# Altium schematic sheet EMG_CHANNEL_2_ANALOG.SchDoc
size 594 x 420 mm
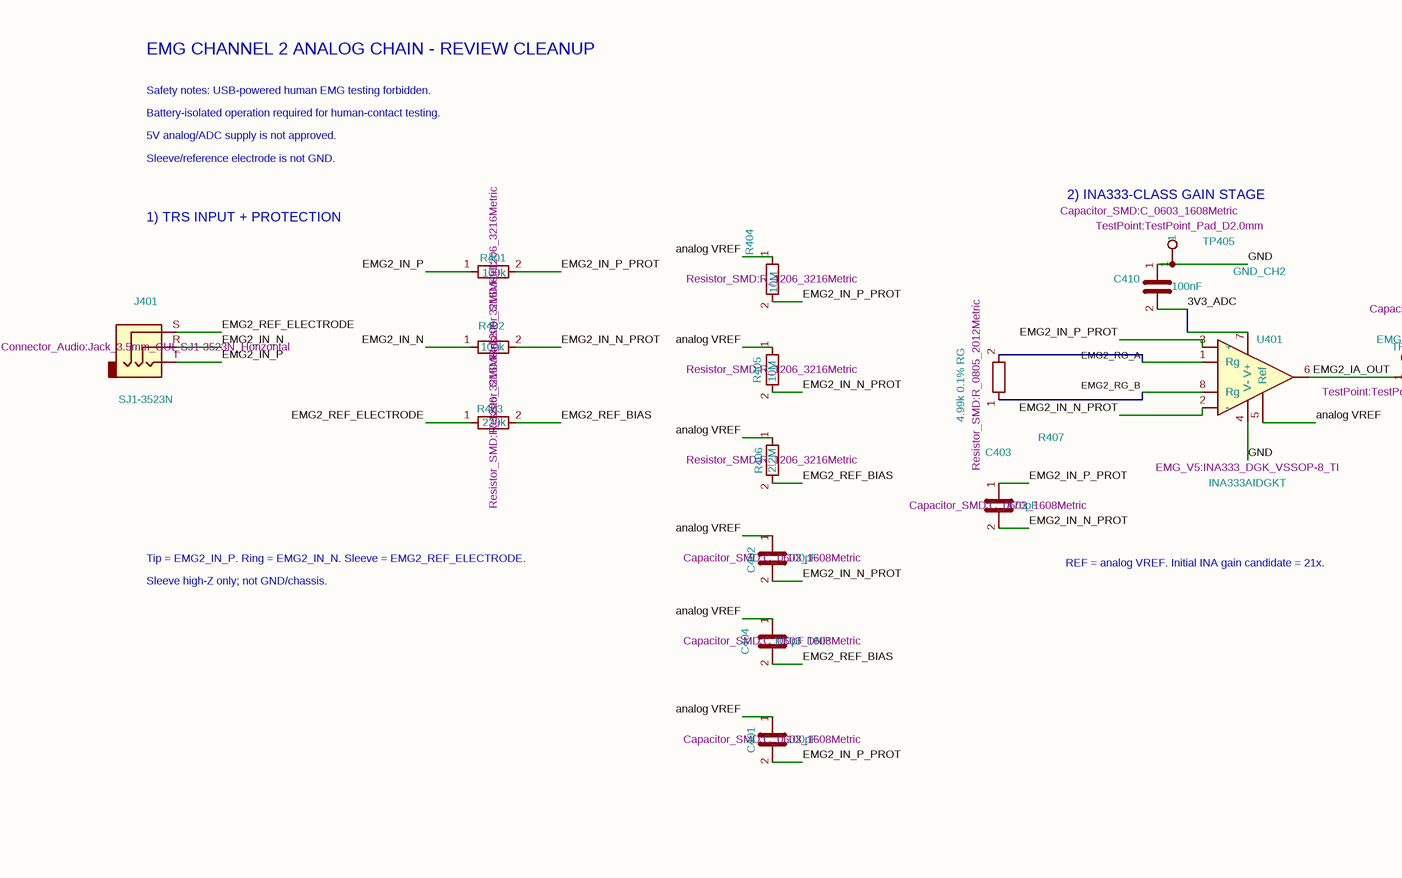
[diagram p0: EMG_CHANNEL_2_ANALOG.SchDoc, left]
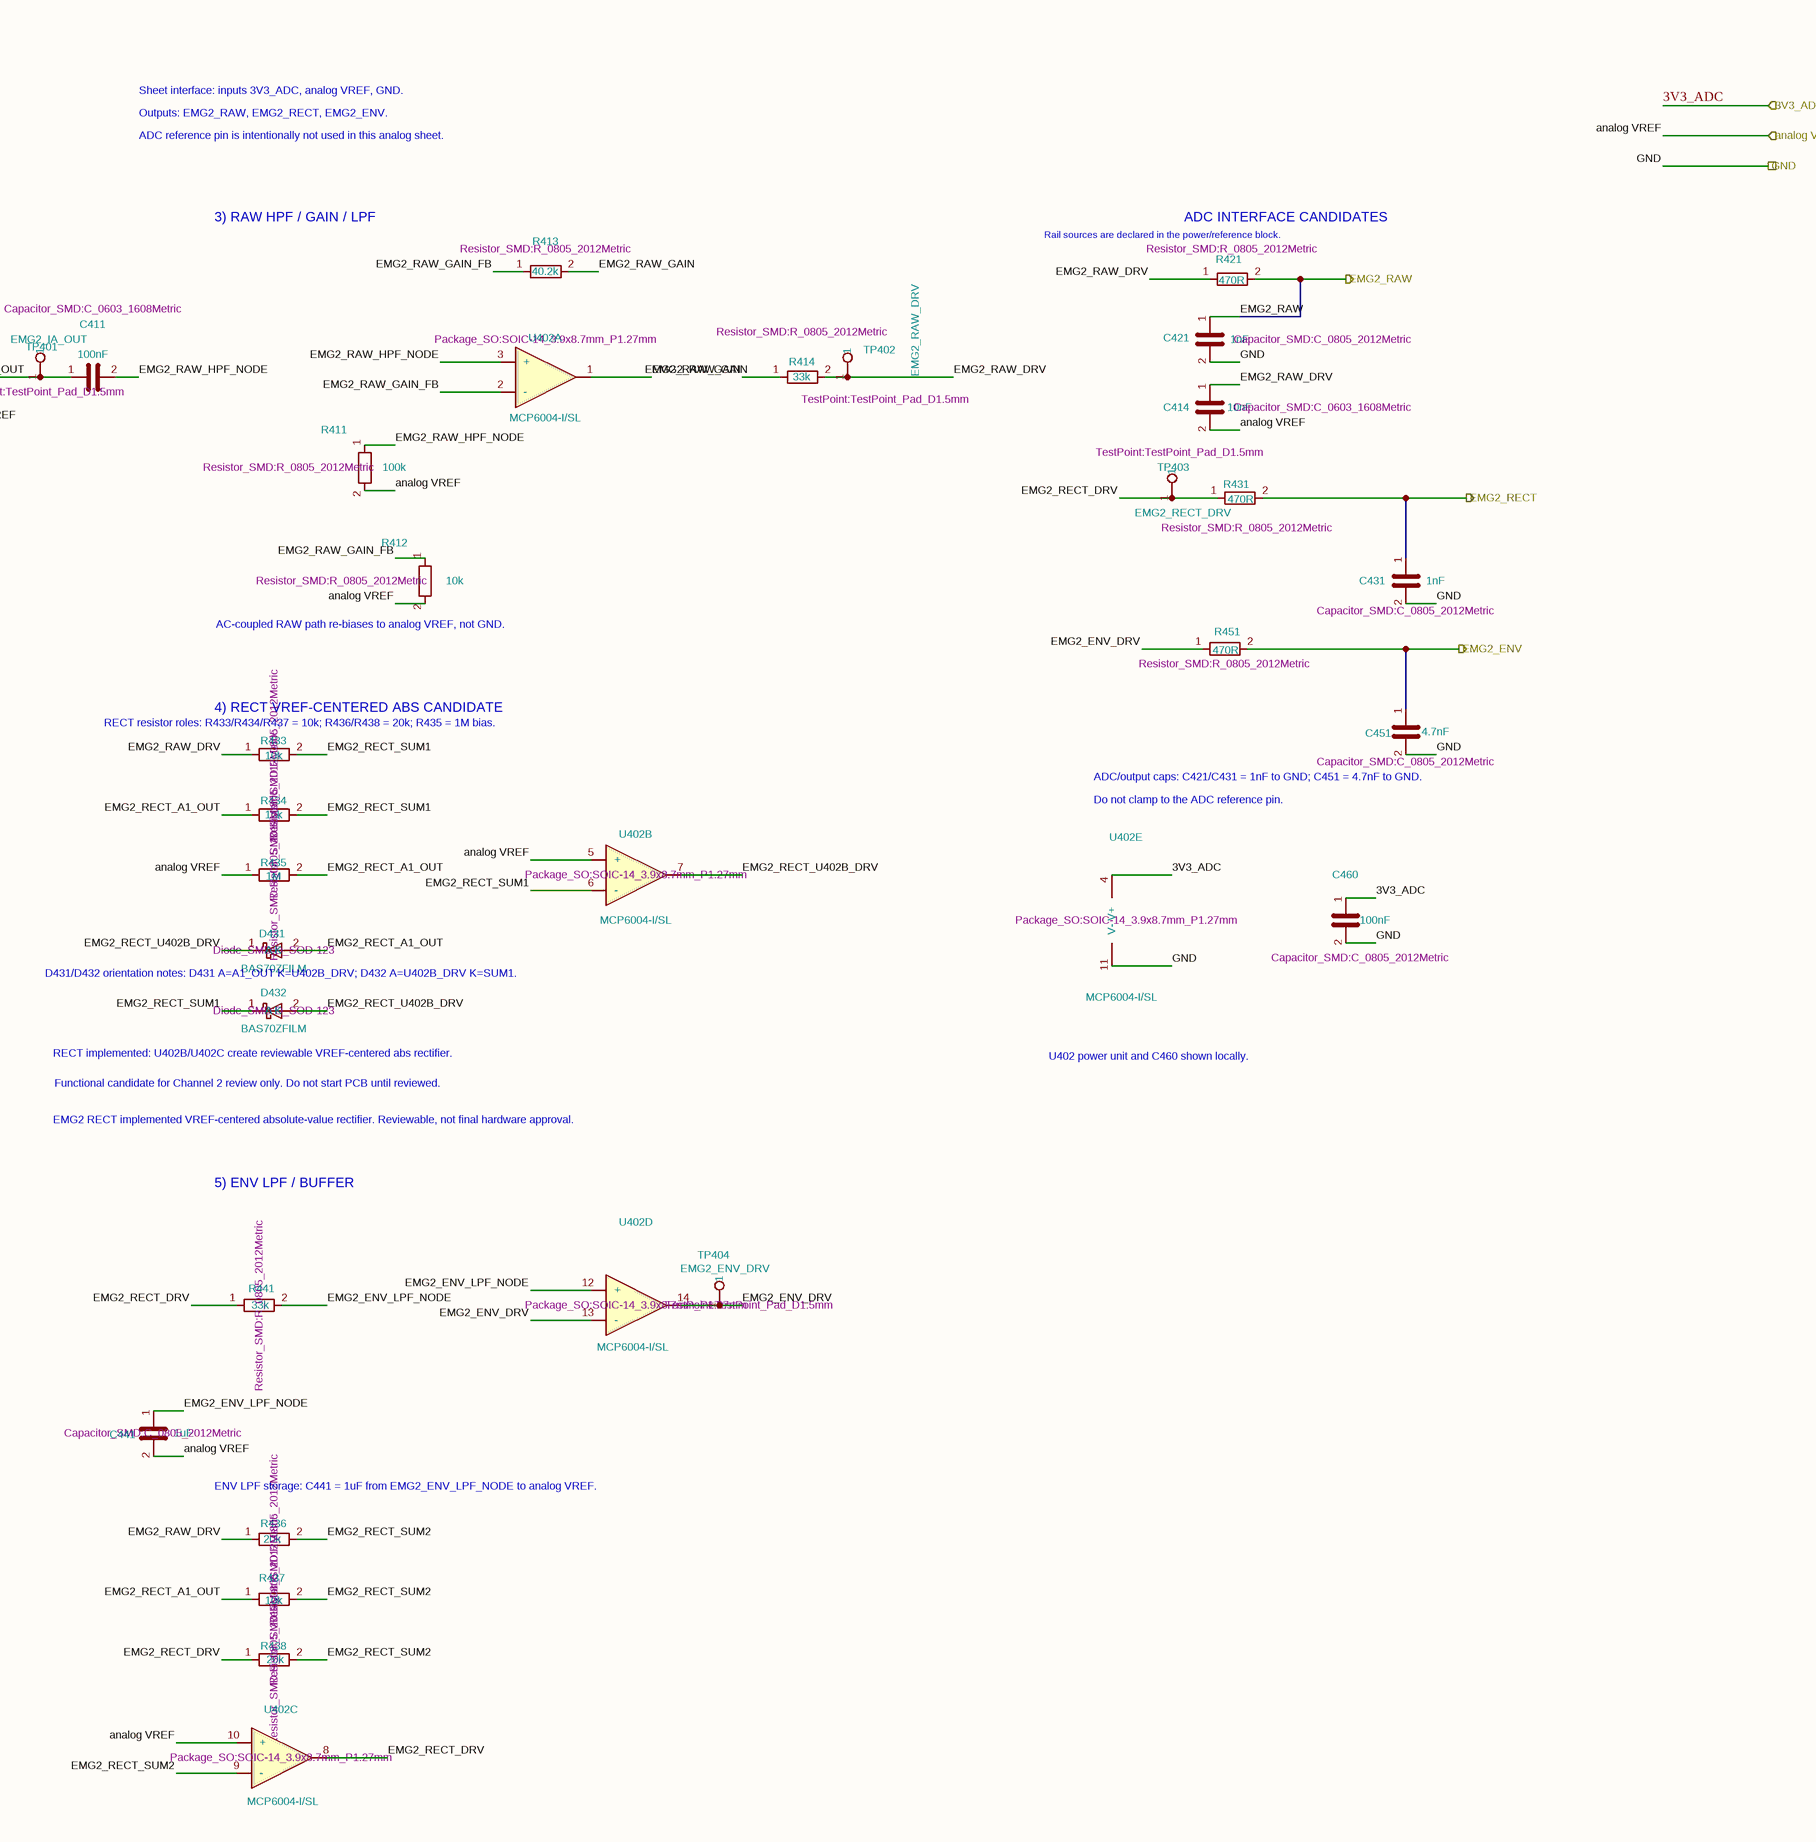
[diagram p1: EMG_CHANNEL_2_ANALOG.SchDoc, right]

## Parts
C401  Footprint: Capacitor_SMD:C_0603_1608Metric  [C_0603_1608Metric]  (hidden comment: 100pF)
C402  Footprint: Capacitor_SMD:C_0603_1608Metric  [C_0603_1608Metric]  (hidden comment: 100pF)
C403  Footprint: Capacitor_SMD:C_0603_1608Metric  [C_0603_1608Metric]  (hidden comment: 470pF)
C404  Footprint: Capacitor_SMD:C_0603_1608Metric  [C_0603_1608Metric]  (hidden comment: 100pF DNP)
C410  Footprint: Capacitor_SMD:C_0603_1608Metric  [C_0603_1608Metric]  (hidden comment: 100nF)
C411  Footprint: Capacitor_SMD:C_0603_1608Metric  [C_0603_1608Metric]  (hidden comment: 100nF)
C414  Footprint: Capacitor_SMD:C_0603_1608Metric  [C_0603_1608Metric]  (hidden comment: 10nF)
C421  Footprint: Capacitor_SMD:C_0805_2012Metric  [C_0805_2012Metric]  (hidden comment: 1nF)
C431  Footprint: Capacitor_SMD:C_0805_2012Metric  [C_0805_2012Metric]  (hidden comment: 1nF)
C441  Footprint: Capacitor_SMD:C_0805_2012Metric  [C_0805_2012Metric]  (hidden comment: 1uF)
C451  Footprint: Capacitor_SMD:C_0805_2012Metric  [C_0805_2012Metric]  (hidden comment: 4.7nF)
C460  Footprint: Capacitor_SMD:C_0805_2012Metric  [C_0805_2012Metric]  (hidden comment: 100nF)
D431  Footprint: Diode_SMD:D_SOD-123  [D_SOD-123]  (hidden comment: BAS70ZFILM)
D432  Footprint: Diode_SMD:D_SOD-123  [D_SOD-123]  (hidden comment: BAS70ZFILM)
J401  Footprint: Connector_Audio:Jack_3.5mm_CUI_SJ1-3523N_Horizontal  [Jack_3.5mm_CUI_SJ1-3523N_Horizontal]  (hidden comment: SJ1-3523N)
R401  Footprint: Resistor_SMD:R_1206_3216Metric  [R_1206_3216Metric]  (hidden comment: 100k)
R402  Footprint: Resistor_SMD:R_1206_3216Metric  [R_1206_3216Metric]  (hidden comment: 100k)
R403  Footprint: Resistor_SMD:R_1206_3216Metric  [R_1206_3216Metric]  (hidden comment: 220k)
R404  Footprint: Resistor_SMD:R_1206_3216Metric  [R_1206_3216Metric]  (hidden comment: 10M)
R405  Footprint: Resistor_SMD:R_1206_3216Metric  [R_1206_3216Metric]  (hidden comment: 10M)
R406  Footprint: Resistor_SMD:R_1206_3216Metric  [R_1206_3216Metric]  (hidden comment: 2.2M)
R407  Footprint: Resistor_SMD:R_0805_2012Metric  [R_0805_2012Metric]  (hidden comment: 4.99k 0.1% RG)
R411  Footprint: Resistor_SMD:R_0805_2012Metric  [R_0805_2012Metric]  (hidden comment: 100k)
R412  Footprint: Resistor_SMD:R_0805_2012Metric  [R_0805_2012Metric]  (hidden comment: 10k)
R413  Footprint: Resistor_SMD:R_0805_2012Metric  [R_0805_2012Metric]  (hidden comment: 40.2k)
R414  Footprint: Resistor_SMD:R_0805_2012Metric  [R_0805_2012Metric]  (hidden comment: 33k)
R421  Footprint: Resistor_SMD:R_0805_2012Metric  [R_0805_2012Metric]  (hidden comment: 470R)
R431  Footprint: Resistor_SMD:R_0805_2012Metric  [R_0805_2012Metric]  (hidden comment: 470R)
R433  Footprint: Resistor_SMD:R_0805_2012Metric  [R_0805_2012Metric]  (hidden comment: 10k)
R434  Footprint: Resistor_SMD:R_0805_2012Metric  [R_0805_2012Metric]  (hidden comment: 10k)
R435  Footprint: Resistor_SMD:R_0805_2012Metric  [R_0805_2012Metric]  (hidden comment: 1M)
R436  Footprint: Resistor_SMD:R_0805_2012Metric  [R_0805_2012Metric]  (hidden comment: 20k)
R437  Footprint: Resistor_SMD:R_0805_2012Metric  [R_0805_2012Metric]  (hidden comment: 10k)
R438  Footprint: Resistor_SMD:R_0805_2012Metric  [R_0805_2012Metric]  (hidden comment: 20k)
R441  Footprint: Resistor_SMD:R_0805_2012Metric  [R_0805_2012Metric]  (hidden comment: 33k)
R451  Footprint: Resistor_SMD:R_0805_2012Metric  [R_0805_2012Metric]  (hidden comment: 470R)
TP401  Footprint: TestPoint:TestPoint_Pad_D1.5mm  [TestPoint_Pad_D1.5mm]  (hidden comment: EMG2_IA_OUT)
TP402  Footprint: TestPoint:TestPoint_Pad_D1.5mm  [TestPoint_Pad_D1.5mm]  (hidden comment: EMG2_RAW_DRV)
TP403  Footprint: TestPoint:TestPoint_Pad_D1.5mm  [TestPoint_Pad_D1.5mm]  (hidden comment: EMG2_RECT_DRV)
TP404  Footprint: TestPoint:TestPoint_Pad_D1.5mm  [TestPoint_Pad_D1.5mm]  (hidden comment: EMG2_ENV_DRV)
TP405  Footprint: TestPoint:TestPoint_Pad_D2.0mm  [TestPoint_Pad_D2.0mm]  (hidden comment: GND_CH2)
U401  Footprint: EMG_V5:INA333_DGK_VSSOP-8_TI  [INA333_DGK_VSSOP-8_TI]  (hidden comment: INA333AIDGKT)
U402  Footprint: Package_SO:SOIC-14_3.9x8.7mm_P1.27mm  [SOIC-14_3.9x8.7mm_P1.27mm]  (hidden comment: MCP6004-I/SL)  (parts A,B,C,D,E of 5)

## Ports
3V3_ADC (in), analog VREF (in), EMG2_ENV (out), EMG2_RAW (out), EMG2_RECT (out), GND

## Nets
3V3_ADC: C410.2 C460.1 U401.7(V+) U402.4(V+) ; port 3V3_ADC
analog VREF: C401.1 C402.1 C404.1 C414.2 C441.2 R404.1 R405.1 R406.1 R411.2 R412.2 R435.1 U401.5(Ref) U402.5(+) U402.10(+) ; port analog VREF
EMG2_ENV: C451.1 R451.2 ; port EMG2_ENV
EMG2_ENV_DRV: R451.1 TP404.1 U402.13(-) U402.14
EMG2_ENV_LPF_NODE: C441.1 R441.2 U402.12(+)
EMG2_IA_OUT: C411.1 TP401.1 U401.6
EMG2_IN_N: J401.R R402.1
EMG2_IN_N_PROT: C402.2 C403.2 R402.2 R405.2 U401.2(-)
EMG2_IN_P: J401.T R401.1
EMG2_IN_P_PROT: C401.2 C403.1 R401.2 R404.2 U401.3(+)
EMG2_RAW: C421.1 R421.2 ; port EMG2_RAW
EMG2_RAW_DRV: C414.1 R414.2 R421.1 R433.1 R436.1 TP402.1
EMG2_RAW_GAIN: R413.2 R414.1 U402.1
EMG2_RAW_GAIN_FB: R412.1 R413.1 U402.2(-)
EMG2_RAW_HPF_NODE: C411.2 R411.1 U402.3(+)
EMG2_RECT: C431.1 R431.2 ; port EMG2_RECT
EMG2_RECT_A1_OUT: D431.2(A) R434.1 R435.2 R437.1
EMG2_RECT_DRV: R431.1 R438.1 R441.1 TP403.1 U402.8
EMG2_RECT_SUM1: D432.1(K) R433.2 R434.2 U402.6(-)
EMG2_RECT_SUM2: R436.2 R437.2 R438.2 U402.9(-)
EMG2_RECT_U402B_DRV: D431.1(K) D432.2(A) U402.7
EMG2_REF_BIAS: C404.2 R403.2 R406.2
EMG2_REF_ELECTRODE: J401.S R403.1
EMG2_RG_A: R407.2 U401.1(Rg)
EMG2_RG_B: R407.1 U401.8(Rg)
GND: C410.1 C421.2 C431.2 C451.2 C460.2 TP405.1 U401.4(V-) U402.11(V-) ; port GND

## Notes on the sheet
- EMG CHANNEL 2 ANALOG CHAIN - REVIEW CLEANUP
- Safety notes: USB-powered human EMG testing forbidden.
- Battery-isolated operation required for human-contact testing.
- Sheet interface: inputs 3V3_ADC, analog VREF, GND.
- Outputs: EMG2_RAW, EMG2_RECT, EMG2_ENV.
- 5V analog/ADC supply is not approved.
- Sleeve/reference electrode is not GND.
- (near TP405) 2) INA333-CLASS GAIN STAGE
- ADC reference pin is intentionally not used in this analog sheet.
- 1) TRS INPUT + PROTECTION
- 3) RAW HPF / GAIN / LPF
- (near R421) Rail sources are declared in the power/reference block.
- (near R421) ADC INTERFACE CANDIDATES
- Tip = EMG2_IN_P. Ring = EMG2_IN_N. Sleeve = EMG2_REF_ELECTRODE.
- REF = analog VREF. Initial INA gain candidate = 21x.
- Sleeve high-Z only; not GND/chassis.
- (near R412) AC-coupled RAW path re-biases to analog VREF, not GND.
- (near R433) RECT resistor roles: R433/R434/R437 = 10k; R436/R438 = 20k; R435 = 1M bias.
- (near R433) 4) RECT VREF-CENTERED ABS CANDIDATE
- (near C451) ADC/output caps: C421/C431 = 1nF to GND; C451 = 4.7nF to GND.
- Do not clamp to the ADC reference pin.
- D431/D432 orientation notes: D431 A=A1_OUT K=U402B_DRV; D432 A=U402B_DRV K=SUM1.
- (near D432) RECT implemented: U402B/U402C create reviewable VREF-centered abs rectifier.
- Functional candidate for Channel 2 review only. Do not start PCB until reviewed.
- U402 power unit and C460 shown locally.
- EMG2 RECT implemented VREF-centered absolute-value rectifier. Reviewable, not final hardware approval.
- 5) ENV LPF / BUFFER
- (near R436) ENV LPF storage: C441 = 1uF from EMG2_ENV_LPF_NODE to analog VREF.
- 1
- 2
- 3
- 4
- 5
- 6
- 7
- 8
- 9
- 10
- 11
- A
- B
- C
- D
- E
- F
- G
- H
- Title:
- File: EMG_CHANNEL_2_ANALOG.kicad_sch
- Sheet: /
- KiCad E.D.A.  kicad (5.1.4)-1
- Size: A2
- Date:
- Rev:
- Id: 1/1

## Library data of the parts
C401-C404 C410 C411 C414 C421 C431 C441 C451 C460 = C
  C401 C402: Value: 100pF
  C403: Value: 470pF
  C404: Value: 100pF DNP
  C410 C411 C460: Value: 100nF
  C414: Value: 10nF
  C421 C431: Value: 1nF
  C441: Value: 1uF
  C451: Value: 4.7nF
D431 D432 = D_Schottky: Value: BAS70ZFILM
J401 = AudioJack3: Value: SJ1-3523N
R401-R407 R411-R414 R421 R431 R433-R438 R441 R451 = R
  R401 R402 R411: Value: 100k
  R403: Value: 220k
  R404 R405: Value: 10M
  R406: Value: 2.2M
  R407: Value: 4.99k 0.1% RG
  R412 R433 R434 R437: Value: 10k
  R413: Value: 40.2k
  R414 R441: Value: 33k
  R421 R431 R451: Value: 470R
  R435: Value: 1M
  R436 R438: Value: 20k
TP401-TP405 = TestPoint
  TP401: Value: EMG2_IA_OUT
  TP402: Value: EMG2_RAW_DRV
  TP403: Value: EMG2_RECT_DRV
  TP404: Value: EMG2_ENV_DRV
  TP405: Value: GND_CH2
U401 = INA333xxDGK: Value: INA333AIDGKT
U402 = MCP6004: Value: MCP6004-I/SL